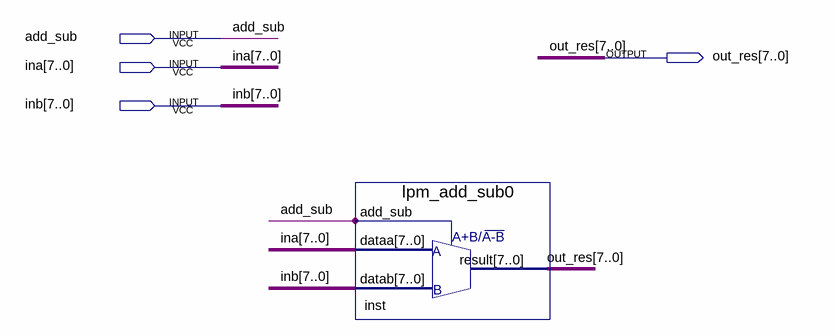
[diagram p0: schematic sheet]
// Quartus schematic Phase1.bdf as structural Verilog: 1 symbols, 4 pins
module Phase1 (
  input  add_sub,
  input  [7:0] ina,
  input  [7:0] inb,
  output [7:0] out_res
);

  lpm_add_sub0 inst (.add_sub(add_sub), .dataa(ina), .datab(inb), .result(out_res));
endmodule
